# Altium project DCDC_IBB_-12V_V01.PrjPcb
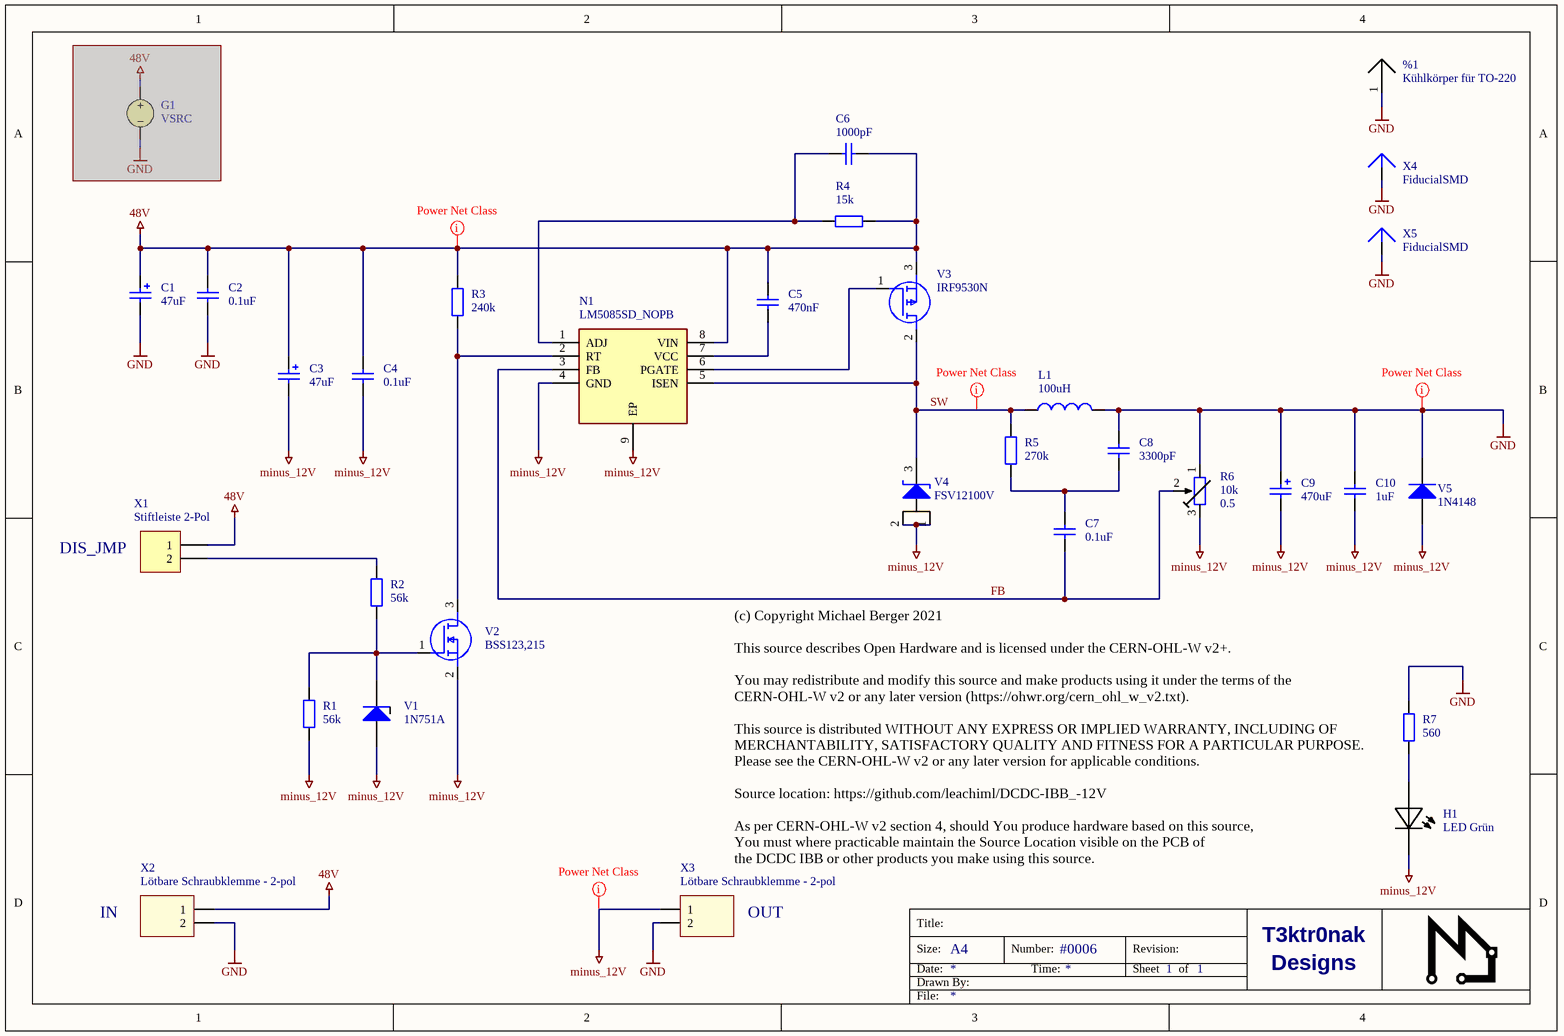
[diagram p0: Topsheet.SchDoc]
Designers: Michael Berger; PCBName: DCDC IBB; PCBRevision: V1; Scaleing: 2
1 sheet, 32 parts. Net scope: global (net labels, ports and power ports of the same name join across sheets).
Board file: DCDC_IBB_-12V_V01.PcbDoc

## Sheet Topsheet.SchDoc: =PCBName+ '+48V to -12V 2A'
size A4; DrawnBy: Michael Berger; DocumentNumber: #0006; Revision: V1; SheetNumber: 1; SheetTotal: 1

### Parts
%1  Kühlkörper für TO-220  [SK 104/25,4 STS]
C1  47uF  [WCAP-ATG5_D6.3H11]
C2  0.1uF  [C0805]
C3  47uF  [WCAP-ATG5_D6.3H11]
C4  0.1uF  [C0805]
C5  470nF  [C1206]
C6  1000pF  [C1206]
C7  0.1uF  [C0805]
C8  3300pF  [C1206]
C9  470uF  [WCAP-ATG5_D8H11.5]
C10  1uF  [C1206]
G1  VSRC  (masked out: inside a compile mask, not in the netlist)
H1  LED Grün  [1206_Marked]
L1  100uH  [INDPM120120X1020N]
N1  LM5085SD_NOPB  [SON50P300X300X80-9N]
R1  56k  [C1206]
R2  56k  [C1206]
R3  240k  [C1206]
R4  15k  [C1206]
R5  270k  [C1206]
R6  10k  Set Position: 0.5  [64W-2,0M]
R7  560  [C1206]
V1  1N751A  [DO-35]
V2  BSS123,215  [SOT95P230X110-3N]
V3  IRF9530N  [TO254P469X1042X1967-3P]
V4  FSV12100V  [FSV1045V]
V5  1N4148  [DO-35]
X1  Stiftleiste 2-Pol  [HDR1X2]
X2  Lötbare Schraubklemme - 2-pol  [Terminal Block 2Pol RM5mm]
X3  Lötbare Schraubklemme - 2-pol  [Terminal Block 2Pol RM5mm]
X4  FiducialSMD  [PIN1RoundSMD]
X5  FiducialSMD  [PIN1RoundSMD]

### Nets
48V: C1.1(P) C2.2 C3.1(P) C4.2 C5.2 C6.1 N1.8(VIN) R3.2 R4.1 V3.3(S) X1.1 X2.1
GND: %1.1 C1.2(N) C2.1 C8.2 C9.1(P) C10.2 L1.2 R6.1 R7.2 V5.2(K) X2.2 X3.2 X4.1 X5.1
minus_12V: C3.2(N) C4.1 C9.2(N) C10.1 H1.K N1.4(GND) N1.9(EP) R1.1 R6.3 V1.1(A) V2.2(S) V4.1(A) V4.2(A_2) V5.1(A) X3.1
FB: C7.1 N1.3(FB) R6.2
SW: L1.1 N1.5(ISEN) R5.2 V3.2(D) V4.3(K)
NetC5_1: C5.1 N1.7(VCC)
NetC6_2: C6.2 N1.1(ADJ) R4.2
NetC7_2: C7.2 C8.1 R5.1
NetH1_A: H1.A R7.1
NetN1_2: N1.2(RT) R3.1 V2.3(D)
NetN1_6: N1.6(PGATE) V3.1(G)
NetR1_2: R1.2 R2.1 V1.2(K) V2.1(G)
NetR2_2: R2.2 X1.2

### Layout directives
net class Power: 48V, GND, minus_12V, SW

### Notes on the sheet
- DIS_JMP
- IN
- (c) Copyright Michael Berger 2021
  This source describes Open Hardware and is licensed under the CERN-OHL-W v2+.
  You may redistribute and modify this source and make products using it under the terms of the
  CERN-OHL-W v2 or any later version (https://ohwr.org/cern_ohl_w_v2.txt).
  This source is distributed WITHOUT ANY EXPRESS OR IMPLIED WARRANTY, INCLUDING OF MERCHANTABILITY, SATISFACTORY QUALITY AND FITNESS FOR A PARTICULAR PURPOSE.
  Please see the CERN-OHL-W v2 or any later version for applicable conditions.
  Source location: https://github.com/leachiml/DCDC-IBB_-12V
  As per CERN-OHL-W v2 section 4, should You produce hardware based on this source,
  You must where practicable maintain the Source Location visible on the PCB of
  the DCDC IBB or other products you make using this source.
- OUT
- Title:
- Size:
- Date:
- Drawn By:
- A4
- Number:
- Time:
- Revision:
- Sheet
- of
- T3ktr0nak
- Designs
- File:

### Library data of the parts
%1 = Placeholder: Mechanische Komponenten Platzhalter; Manufacturer: Fischer Elektronik; Orderingcode: SK 104/25,4 STS; Bezeichnung: Kühlkörper für TO-220
C1 C3 = 860020773013: =Bezeichnung; Manufacturer: Wurth Elektronik; Endurance: 2000h; Ripple Current: 125mA; Technical Reference: ATDD110470M063DSPA4B000; Dissipation Factor: 9%; Capacitance Tolerance: +/-20%; Leakage Current: 29.61uA; Rated Voltage: 63VDC; Bezeichnung: WCAP-ATG5 Aluminum Electrolytic Capacitor, Radial, THT, D6.3xH11, 47uF, 63V; Height: 11mm; ComponentLink1URL: http://www.we-online.de; ComponentLink2URL: https://www.we-online.com/catalog/datasheet/860020773013.pdf; ComponentLink2Description: Datasheet; Diameter: 6.3mm; Mounting Technology: THT; Capacitance: 47uF; Orderingcode: 860020773013; Packaging: Ammo Pack; Published Date: October 2020; ComponentLink1Description: Manufacturer; Operating Temperature: -40 to +105degC
C2 C4 C7 = Cap Semi: Capacitor (Semiconductor SIM Model); Manufacturer: KEMET; Orderingcode: C0805C104KMREC7210; Bezeichnung: Kerko 63V; Published: 8-Jun-2000; LatestRevisionDate: 29-May-2009; LatestRevisionNote: IPC-7351 Footprint Added.; PackageReference: C1206; Publisher: Altium Limited; PackageDescription: Chip Capacitor; Value: 0.1uF
C5 = Cap Semi: Capacitor (Semiconductor SIM Model); Manufacturer: KEMET; Orderingcode: C1206C474KMREC7210; Bezeichnung: Kerko 16V; Published: 8-Jun-2000; LatestRevisionDate: 29-May-2009; LatestRevisionNote: IPC-7351 Footprint Added.; PackageReference: C1206; Publisher: Altium Limited; PackageDescription: Chip Capacitor; Value: 470nF
C6 = Cap Semi: Capacitor (Semiconductor SIM Model); Manufacturer: KEMET; Orderingcode: C1206C102KMRECTU; Bezeichnung: Kerko 63V; Published: 8-Jun-2000; LatestRevisionDate: 29-May-2009; LatestRevisionNote: IPC-7351 Footprint Added.; PackageReference: C1206; Publisher: Altium Limited; PackageDescription: Chip Capacitor; Value: 1000pF
C8 = Cap Semi: Capacitor (Semiconductor SIM Model); Manufacturer: KEMET; Orderingcode: C1206C332K1RAC7553; Bezeichnung: Kerko 63V; Published: 8-Jun-2000; LatestRevisionDate: 29-May-2009; LatestRevisionNote: IPC-7351 Footprint Added.; PackageReference: C1206; Publisher: Altium Limited; PackageDescription: Chip Capacitor; Value: 3300pF
C9 = 860020374012: =Bezeichnung; Manufacturer: Wurth Elektronik; Endurance: 2000h; Ripple Current: 370mA; Technical Reference: ATDE115471M016DSPA7B000; Dissipation Factor: 15%; Capacitance Tolerance: +/-20%; Leakage Current: 75.2uA; Rated Voltage: 16VDC; Bezeichnung: WCAP-ATG5 Aluminum Electrolytic Capacitor, Radial, THT, D8xH11.5, 470uF, 16V; Height: 11.5mm; ComponentLink1URL: http://www.we-online.de; ComponentLink2URL: https://www.we-online.com/catalog/datasheet/860020374012.pdf; ComponentLink2Description: Datasheet; Diameter: 8mm; Mounting Technology: THT; Capacitance: 470uF; Orderingcode: 860020374012; Packaging: Ammo Pack; Published Date: October 2020; ComponentLink1Description: Manufacturer; Operating Temperature: -40 to +105degC
C10 = Cap Semi: Capacitor (Semiconductor SIM Model); Manufacturer: KEMET; Orderingcode: C1206C105K5RACTU; Bezeichnung: Kerko 63V; Published: 8-Jun-2000; LatestRevisionDate: 29-May-2009; LatestRevisionNote: IPC-7351 Footprint Added.; PackageReference: C1206; Publisher: Altium Limited; PackageDescription: Chip Capacitor; Value: 1uF
G1 = VSRC: Voltage Source; Note: PCB Footprint - Not required; Value: 48; Published: 8-Jun-2000; LatestRevisionDate: 17-Jul-2002; LatestRevisionNote: Re-released for DXP Platform.; PackageReference: Not Applicable; Publisher: Altium Limited
H1 = LED 5mm, 2.54mm Rastermaß, 0.5mm: LED 5mm, 2.54mm Rastermaß, 0.5mm Beinchendurchmesser; pin to pad: A>2 K>1; Manufacturer: Stanley Electric; Bezeichnung: LED 20mA 1206 Grün; Orderingcode: RPG1102W-660-TR
L1 = Inductor: Manufacturer: Coilcraft; Code_IEC: 1005; Orderingcode: MSS1210-104KED; Bezeichnung: Spule 100uH; 3.4A; MSS1210-104KED; Published: 8-Jun-2000; LatestRevisionDate: 29-May-2009; LatestRevisionNote: IPC-7351 Footprint Added.; PackageReference: 0402-A; Publisher: Altium Limited; PackageDescription: Chip Inductor; Code_JEITA: 0402; Value: 100uH
N1 = LM5085SD_NOPB: Integrated Circuit; Manufacturer_Name: Texas Instruments; Manufacturer_Part_Number: LM5085SD/NOPB; Datasheet Link: http://www.ti.com/lit/gpn/lm5085; Height: 0.8mm; Arrow Part Number: LM5085SD/NOPB; Arrow Price/Stock: https://www.arrow.com/en/products/lm5085sdnopb/texas-instruments; Mouser Part Number: 926-LM5085SD/NOPB; Mouser Price/Stock: https://www.mouser.co.uk/ProductDetail/Texas-Instruments/LM5085SD-NOPB?qs=QbsRYf82W3Ha5v5j3YN%2FqQ%3D%3D
R1-R5 R7 = Res2: Resistor; Published: 8-Jun-2000; LatestRevisionDate: 17-Jul-2002; LatestRevisionNote: Re-released for DXP Platform.; PackageReference: AXIAL-0.4; Publisher: Altium Limited; PackageDescription: Axial Device, Thru-Hole; 2 Leads; 0.4 in Pin Spacing; Manufacturer: *; Orderingcode: *; Bezeichnung: *
  R1 R2: Value: 56k
  R3: Value: 240k
  R4: Value: 15k
  R5: Value: 270k
  R7: Value: 560
R6 = Präz-Poti: 64W-2,0M Präzisionspotentiometer, 25 Gänge, stehend, 2,0 MOhm; Manufacturer: Suntan; Value: 10k; Orderingcode: *; Bezeichnung: 64W-2,0M Präzisionspotentiometer, 25 Gänge, stehend, 2,0 MOhm
V1 = Diode 1N4148: =Bezeichnung; Bezeichnung: Zener Diode 5,1V; Published: 8-Jun-2000; LatestRevisionDate: 17-Jul-2002; LatestRevisionNote: Re-released for DXP Platform.; DatasheetVersion: 1997; PackageReference: DO-35; Publisher: Altium Limited; PackageDescription: Diode, Axial; Body 3.8 x 1.9 mm (LxDia. max), Lead Dia. 0.53 mm (max); Code_JEDEC: DO-204-AH; ComponentLink1Description: Manufacturer Link; ComponentLink1URL: http://www.fairchildsemi.com/; ComponentLink2Description: Datasheet; ComponentLink2URL: http://www.fairchildsemi.com/ds/1N%2F1N4148.pdf; Manufacturer: *; Orderingcode: *
V2 = BSS123,215: MOSFET (N-Channel); Manufacturer_Name: Nexperia; Datasheet Link: https://componentsearchengine.com/Datasheets/2/BSS123,215.pdf; Height: 1.1mm; Arrow Part Number: BSS123,215; Arrow Price/Stock: https://www.arrow.com/en/products/bss123215/nexperia; Mouser Part Number: 771-BSS123-T/R; Mouser Price/Stock: https://www.mouser.co.uk/ProductDetail/Nexperia/BSS123215?qs=me8TqzrmIYWQISbOHJHs9Q%3D%3D; Manufacturer_Part_Number: BSS123,215
V3 = IRF9530N: MOSFET (P-Channel); Manufacturer_Name: International Rectifier; Datasheet Link: https://www.infineon.com/dgdl/irf9530n.pdf?fileId=5546d462533600a401535611b4a71dbf; Height: 4.69mm; Manufacturer: *; Orderingcode: *; Bezeichnung: *; Manufacturer_Part_Number: IRF9530N
V4 = FSV12100V: Schottky Diode; Bezeichnung: 1N6263 Schottky Diode; Manufacturer: *; Orderingcode: *
V5 = Diode 1N4148: High Conductance Fast Diode; Bezeichnung: Kleinleistungs Diode; Published: 8-Jun-2000; LatestRevisionDate: 17-Jul-2002; LatestRevisionNote: Re-released for DXP Platform.; DatasheetVersion: 1997; PackageReference: DO-35; Publisher: Altium Limited; PackageDescription: Diode, Axial; Body 3.8 x 1.9 mm (LxDia. max), Lead Dia. 0.53 mm (max); Code_JEDEC: DO-204-AH; ComponentLink1Description: Manufacturer Link; ComponentLink1URL: http://www.fairchildsemi.com/; ComponentLink2Description: Datasheet; ComponentLink2URL: http://www.fairchildsemi.com/ds/1N%2F1N4148.pdf; Manufacturer: *; Orderingcode: 1N4148
X1 = Header 2: Header, 2-Pin; Bezeichnung: Stiftleiste RM2,54; LatestRevisionDate: 17-Jul-2002; LatestRevisionNote: Re-released for DXP Platform.; Publisher: Altium Limited; Manufacturer: *; Orderingcode: *
X2 X3 = Terminal-Block 2Pol. RM5mm: Manufacturer: RND; Bezeichnung: Lötbare Schraubklemme - 2-pol, RM 5 mm, 90°; Orderingcode: RND 205-00045
X4 X5 = PlugRoundSMD: LatestRevisionDate: 17-Jul-2002; LatestRevisionNote: Re-released for DXP Platform.; Publisher: Altium Limited